# EAGLE schematic nintendac (EAGLE 7.7.0)
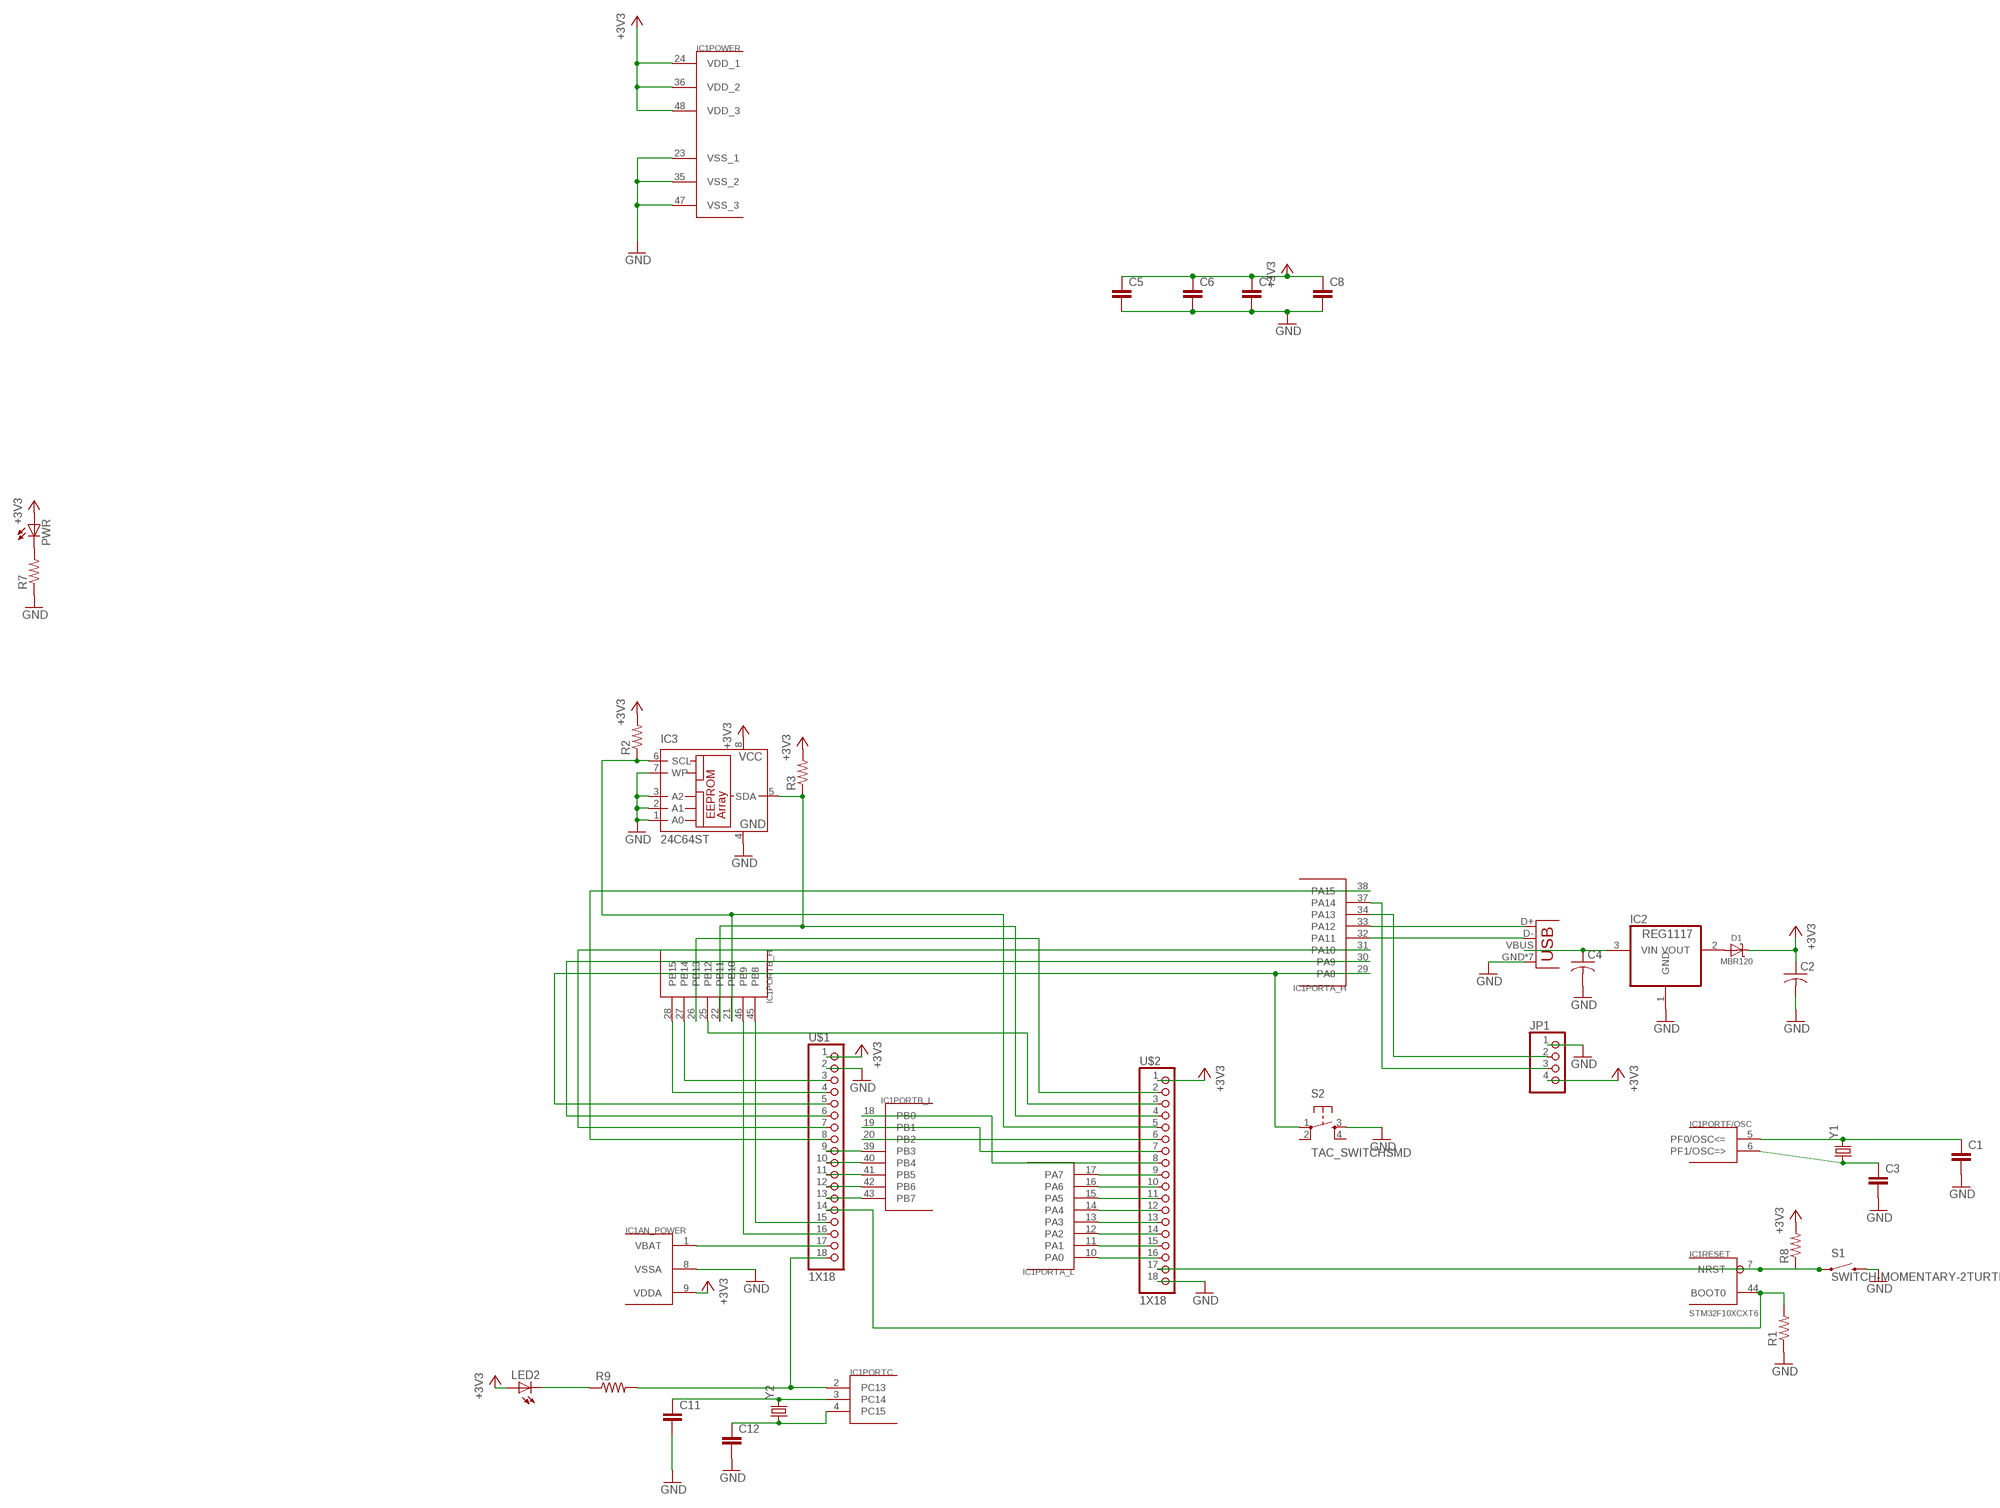
[diagram p0: schematic, sheet 1]

## Parts
C1  CAP0805  [0805]
C2  C-USC1210  [C1210]
C3  CAP0805  [0805]
C4  C-USC1210  [C1210]
C5  CAP0805  [0805]
C6  CAP0805  [0805]
C7  CAP0805  [0805]
C8  CAP0805  [0805]
C11  CAP0805  [0805]
C12  CAP0805  [0805]
D1  MBR120  DIODE-SCHOTTKYSOD-123  [SOD-123]
IC1  STM32F10XCXT6  [TQFP48]
IC2  REG1117  [SOT223]
IC3  24C64ST  [TSSOP8]
JP1  PINHD-1X4  [1X04]
LED2  LEDCHIP-LED0805  [CHIP-LED0805]
PWR  LEDCHIP-LED0805  [CHIP-LED0805]
R1  RESISTOR0805-RES  [0805]
R2  RESISTOR0805-RES  [0805]
R3  RESISTOR0805-RES  [0805]
R7  RESISTOR0805-RES  [0805]
R8  RESISTOR0805-RES  [0805]
R9  RESISTOR0805-RES  [0805]
S1  SWITCH-MOMENTARY-2TURTLE  [KMR2]
S2  TAC_SWITCHSMD  [TACTILE-SWITCH-SMD]
U$1  1X18  [1X18]
U$2  1X18  [1X18]
X1  USB-MICROB  [USB-MICROB]
Y1  CRYSTALHC49US  [HC49US]
Y2  CRYSTALTC26H_EZ  [TC26HEZ]

## Nets
+3V3: C2.1 C5.1 C6.1 C7.1 C8.1 D1.C IC1.9(AN_POWER:VDDA) IC1.24(POWER:VDD_1) IC1.36(POWER:VDD_2) IC1.48(POWER:VDD_3) IC3.8(VCC) JP1.4 LED2.A PWR.A R2.2 R3.2 R8.2 U$1.1 U$2.1
GND: C1.2 C2.2 C3.2 C4.2 C5.2 C6.2 C7.2 C8.2 C11.2 C12.2 IC1.8(AN_POWER:VSSA) IC1.23(POWER:VSS_1) IC1.35(POWER:VSS_2) IC1.47(POWER:VSS_3) IC2.1(GND) IC3.1(A0) IC3.2(A1) IC3.3(A2) IC3.4(GND) IC3.7(WP) JP1.1 R1.1 R7.1 S1.3 S2.3 U$1.2 U$2.18 X1.GND X1.P1(GND) X1.P2(GND) X1.P3(GND) X1.P4(GND) X1.P5(GND) X1.P6(GND)
N$1: IC1.7(RESET:NRST) R8.1 S1.1 U$2.17
N$2: C4.1 IC2.3(VIN) X1.VBUS
N$3: IC1.44(RESET:BOOT0) R1.2 U$1.14
N$4: IC1.33(PORTA_H:PA12) X1.D+
N$5: C1.1 IC1.5(PORTF/OSC:PF0/OSC<=) Y1.2
N$6: C3.1 IC1.6(PORTF/OSC:PF1/OSC=>) Y1.1
N$7: IC1.32(PORTA_H:PA11) X1.D-
N$8: IC1.34(PORTA_H:PA13) JP1.2
N$9: IC1.37(PORTA_H:PA14) JP1.3
N$10: IC1.10(PORTA_L:PA0) U$2.16
N$11: IC1.11(PORTA_L:PA1) U$2.15
N$12: IC1.12(PORTA_L:PA2) U$2.14
N$13: IC1.13(PORTA_L:PA3) U$2.13
N$14: IC1.14(PORTA_L:PA4) U$2.12
N$15: IC1.15(PORTA_L:PA5) U$2.11
N$16: IC1.16(PORTA_L:PA6) U$2.10
N$17: IC1.17(PORTA_L:PA7) U$2.9
N$18: IC1.21(PORTB_H:PB10) IC3.6(SCL) R2.1 U$2.5
N$19: IC1.22(PORTB_H:PB11) IC3.5(SDA) R3.1 U$2.4
N$20: IC1.18(PORTB_L:PB0) U$2.8
N$21: IC1.19(PORTB_L:PB1) U$2.7
N$22: IC1.20(PORTB_L:PB2) U$2.6
N$23: IC1.43(PORTB_L:PB7) U$1.13
N$24: IC1.42(PORTB_L:PB6) U$1.12
N$25: IC1.41(PORTB_L:PB5) U$1.11
N$26: IC1.40(PORTB_L:PB4) U$1.10
N$27: PWR.C R7.2
N$28: C11.1 IC1.3(PORTC:PC14) Y2.2
N$29: C12.1 IC1.4(PORTC:PC15) Y2.1
N$30: IC1.39(PORTB_L:PB3) U$1.9
N$32: IC1.2(PORTC:PC13) R9.2 U$1.18
N$33: IC1.1(AN_POWER:VBAT) U$1.17
N$34: IC1.46(PORTB_H:PB9) U$1.16
N$35: IC1.45(PORTB_H:PB8) U$1.15
N$36: D1.A IC2.2(VOUT)
N$38: IC1.25(PORTB_H:PB12) U$2.3
N$39: IC1.26(PORTB_H:PB13) U$2.2
N$40: IC1.38(PORTA_H:PA15) U$1.8
N$41: IC1.31(PORTA_H:PA10) U$1.7
N$42: IC1.30(PORTA_H:PA9) U$1.6
N$43: IC1.29(PORTA_H:PA8) S2.1 U$1.5
N$44: IC1.27(PORTB_H:PB14) U$1.3
N$45: IC1.28(PORTB_H:PB15) U$1.4
N$65: LED2.C R9.1
Unconnected: S2.2 S2.4

## Library data of the parts
C1 C3 C5-C8 C11 C12 = backplane:CAP: Capacitor Standard 0603 ceramic capacitor, and 0.1" leaded capacitor.
C2 C4 = backplane:C-US: CAPACITOR, American symbol
D1 = microbuilder:DIODE-SCHOTTKY
IC1 = stm32f072c8t6:STM32F10XCXT6: ST STM32F101/103 48pin LQFP
IC2 = backplane:REG1117: 800mA and 1A Low Dropout (LDO) Positive Regulator 1.8V, 2.5V, 2.85V, 3.3V, 5V, and Adj; MPN: REG1117; OC_FARNELL: 1097566; OC_NEWARK: 14P6981
IC3 = microchip:24*: Serial EEPROM I2C; MPN: CAT24C64YI-GT3; OC_FARNELL: 1718133; OC_NEWARK: 08R5418
JP1 = pinhead:PINHD-1X4: PIN HEADER
LED2 PWR = backplane:LED: LED OSRAM: - CHIPLED LG R971, LG N971, LY N971, LG Q971, LY Q971, LO R971, LY R971 LH N974, LH R974 LS Q976, LO Q976, LY Q976 LO Q996 - Hyper CHIPLED LW Q18S LB Q993, LB Q99A, LB R99A - SideLED LS A670, LO A670, LY A670, LG A670, LP A670 LB A673, LV A673, LT A673, LW A673 LH A674 LY A675 LS A676, LA A676, LO A676, LY A676, LW A676 LS A679, LY A679, LG A679 - Hyper Micro SIDELED® LS Y876, LA Y876, LO Y876, LY Y876 LT Y87S - SmartLED LW L88C, LW L88S LB L89C, LB L89S, LG L890 LS L89K, LO L89K, LY L89K LS L896, LA L896, LO L896, LY L896 - TOPLED LS T670, LO T670, LY T670, LG T670, LP T670 LSG T670, LSP T670, LSY T670, LOP T670, LYG T670 LG T671, LOG T671, LSG T671 LB T673, LV T673, LT T673, LW T673 LH T674 LS T676, LA T676, LO T676, LY T676, LB T676, LH T676, LSB T676, LW T676 LB T67C, LV T67C, LT T67C, LS T67K, LO T67K, LY T67K, LW E67C LS E67B, LA E67B, LO E67B, LY E67B, LB E67C, LV E67C, LT E67C LW T67C LS T679, LY T679, LG T679 LS T770, LO T770, LY T770, LG T770, LP T770 LB T773, LV T773, LT T773, LW T773 LH T774 LS E675, LA E675, LY E675, LS T675 LS T776, LA T776, LO T776, LY T776, LB T776 LHGB T686 LT T68C, LB T68C - Hyper Mini TOPLED® LB M676 - Mini TOPLED Santana® LG M470 LS M47K, LO M47K, LY M47K Source: http://www.osram.convergy.de/
R1-R3 R7-R9 = SparkFun-Passives:RESISTOR: Resistor Basic schematic elements and footprints for 0603, 1206, and PTH resistors.
S1 = Adafruit Feather M0 Adalogger:SWITCH-MOMENTARY-2: Various NO switches- pushbuttons, reed, etc
S2 = SparkFun-Retired:TAC_SWITCH: Momentary Switch Button commonly used for reset or general input. Spark Fun Electronics SKU : COM-00097 SMT- SWCH-08247; PROD_ID: SWCH-08247
U$1 U$2 = headers(2mm):1X18
X1 = backplane:USB: USB Connectors USB-B-PTH is fully proven SKU : PRT-00139/CONN-08278 USB-miniB is fully proven SKU : PRT-00587 USB-A-PCB is untested. USB-A-H is throughly reviewed, but untested. Spark Fun Electronics SKU : PRT-00437 USB-B-SMT is throughly reviewed, but untested. Needs silkscreen touching up. USB-A-S has not been used/tested USB-MB-H has not been used/tested USB-MICROB has been used. CONN-09505; PROD_ID: CONN-09505
Y1 Y2 = backplane:CRYSTAL: Various standard crystals. Proven footprints.